# Altium project BackPlane.PrjPcb
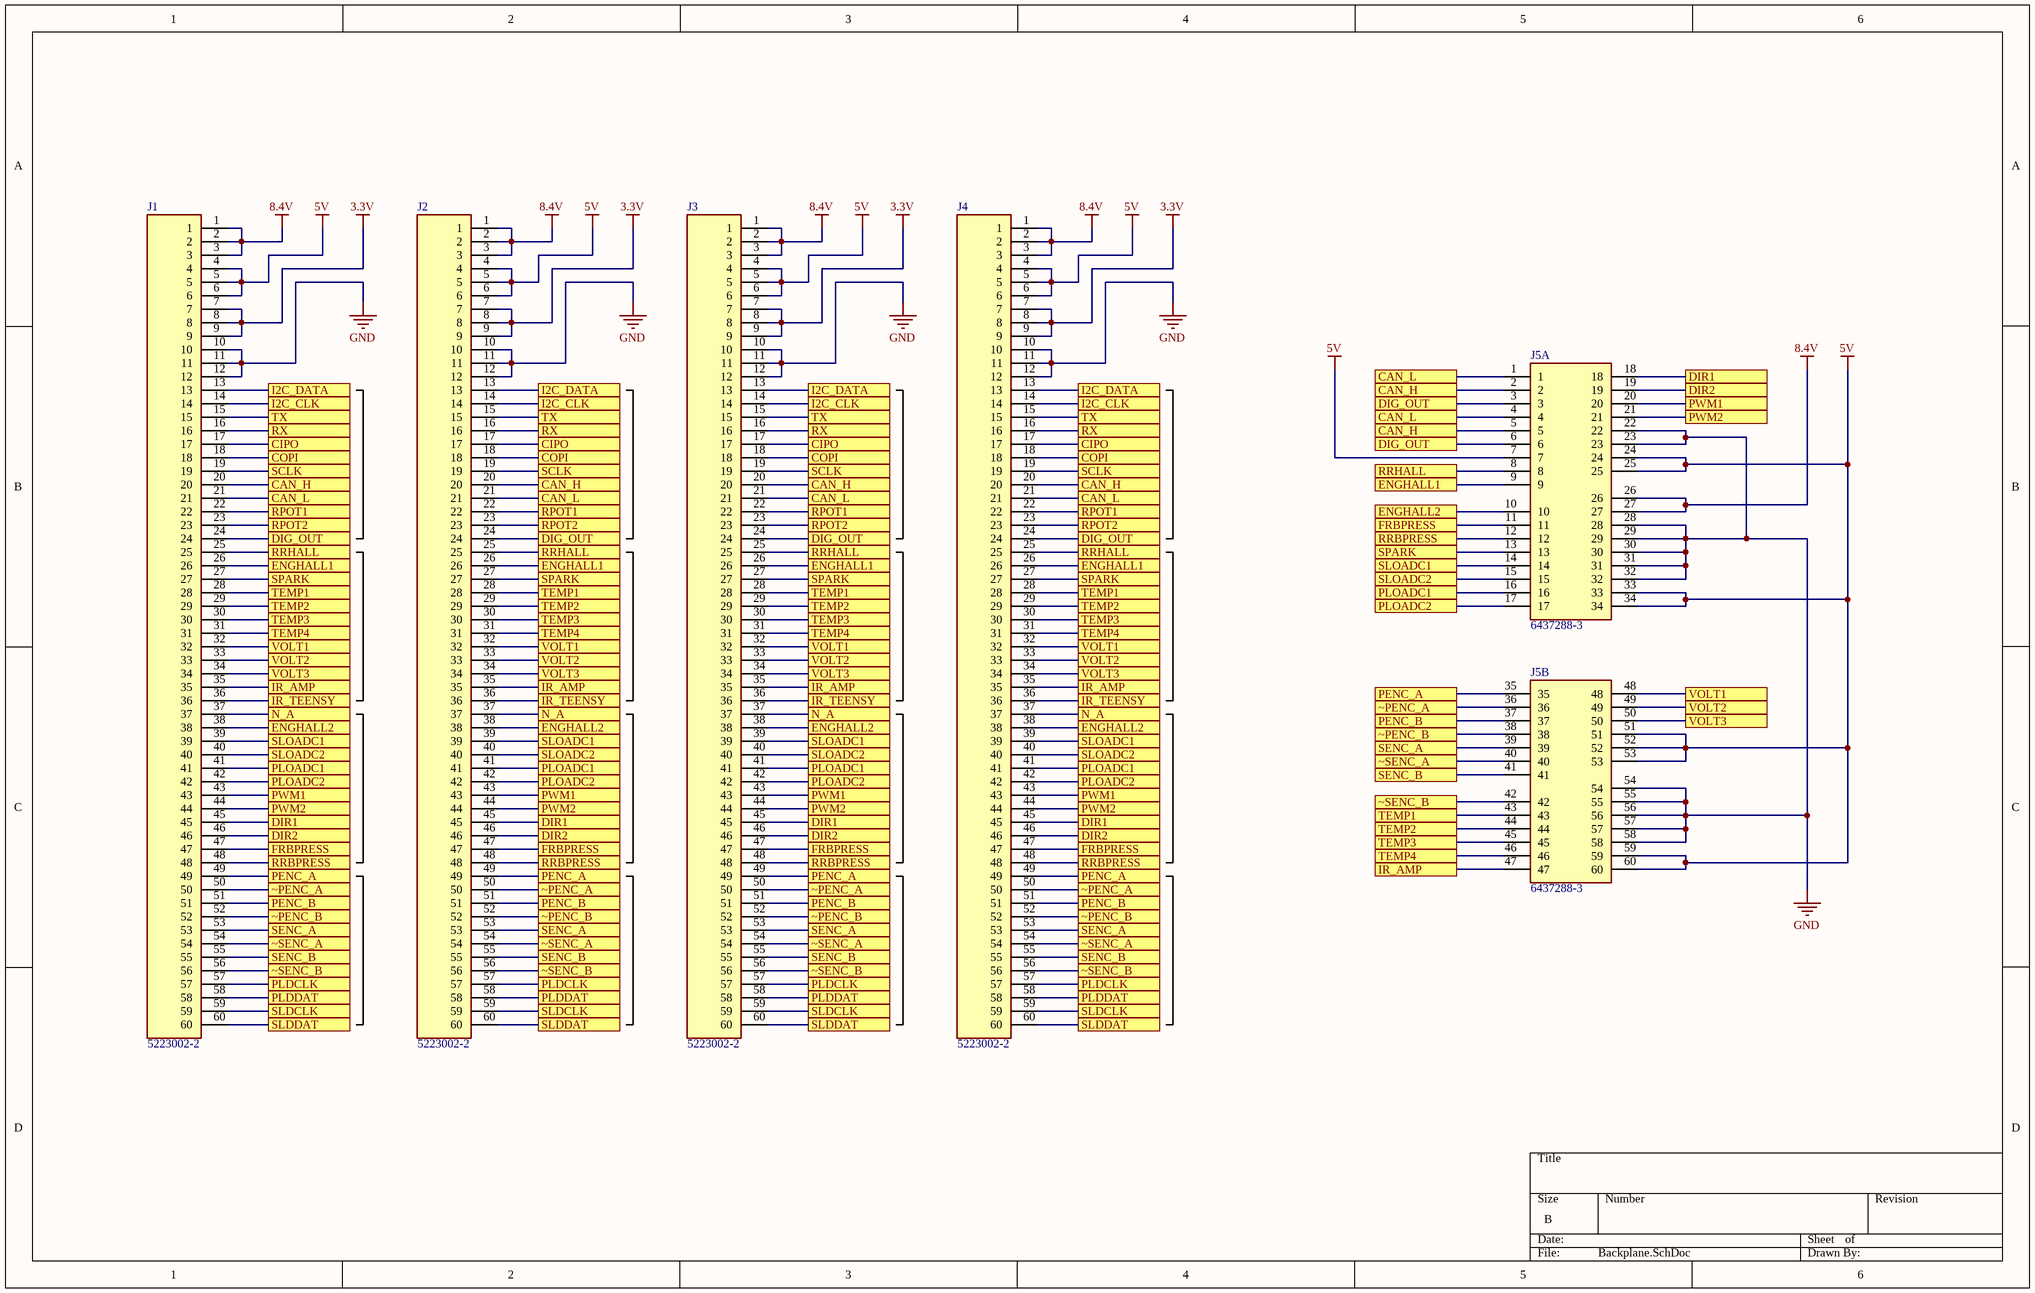
[diagram p0: Backplane.SchDoc]
1 sheet, 5 parts. Net scope: flat (ports and power ports of the same name join across sheets).
Board file: Backplane.PcbDoc

## Sheet Backplane.SchDoc
size B; SheetNumber: 1; SheetTotal: 1

### Parts
J1  5223002-2  [TE_5223002-2]
J2  5223002-2  [TE_5223002-2]
J3  5223002-2  [TE_5223002-2]
J4  5223002-2  [TE_5223002-2]
J5  6437288-3  [TE_6437288-3]  (parts A,B of 2)

### Ports
CAN_H (see Backplane[1B], Backplane[2B], Backplane[3B], Backplane[4B], Backplane[5B]), CAN_H (see Backplane[1B], Backplane[2B], Backplane[3B], Backplane[5B]), CAN_H (see Backplane[1B], Backplane[2B], Backplane[4B], Backplane[5B]), CAN_H (see Backplane[1B], Backplane[3B], Backplane[4B], Backplane[5B]), CAN_H (see Backplane[2B], Backplane[3B], Backplane[4B], Backplane[5B]), CAN_L (see Backplane[1B], Backplane[2B], Backplane[3B], Backplane[4B], Backplane[5B]), CAN_L (see Backplane[1B], Backplane[2B], Backplane[3B], Backplane[5B]), CAN_L (see Backplane[1B], Backplane[2B], Backplane[4B], Backplane[5B]), CAN_L (see Backplane[1B], Backplane[3B], Backplane[4B], Backplane[5B]), CAN_L (see Backplane[2B], Backplane[3B], Backplane[4B], Backplane[5B]), CIPO (see Backplane[1B], Backplane[2B], Backplane[3B]), CIPO (see Backplane[1B], Backplane[2B], Backplane[4B]), CIPO (see Backplane[1B], Backplane[3B], Backplane[4B]), CIPO (see Backplane[2B], Backplane[3B], Backplane[4B]), COPI (see Backplane[1B], Backplane[2B], Backplane[3B]), COPI (see Backplane[1B], Backplane[2B], Backplane[4B]), COPI (see Backplane[1B], Backplane[3B], Backplane[4B]), COPI (see Backplane[2B], Backplane[3B], Backplane[4B]), DIG_OUT (see Backplane[1B], Backplane[2B], Backplane[3B], Backplane[4B], Backplane[5B]), DIG_OUT (see Backplane[1B], Backplane[2B], Backplane[3B], Backplane[5B]), DIG_OUT (see Backplane[1B], Backplane[2B], Backplane[4B], Backplane[5B]), DIG_OUT (see Backplane[1B], Backplane[3B], Backplane[4B], Backplane[5B]), DIG_OUT (see Backplane[2B], Backplane[3B], Backplane[4B], Backplane[5B]), DIR1 (see Backplane[1C], Backplane[2C], Backplane[3C], Backplane[4C]), DIR1 (see Backplane[1C], Backplane[2C], Backplane[3C], Backplane[5B]), DIR1 (see Backplane[1C], Backplane[2C], Backplane[4C], Backplane[5B]), DIR1 (see Backplane[1C], Backplane[3C], Backplane[4C], Backplane[5B]), DIR1 (see Backplane[2C], Backplane[3C], Backplane[4C], Backplane[5B]), DIR2 (see Backplane[1C], Backplane[2C], Backplane[3C], Backplane[4C]), DIR2 (see Backplane[1C], Backplane[2C], Backplane[3C], Backplane[5B]), DIR2 (see Backplane[1C], Backplane[2C], Backplane[4C], Backplane[5B]), DIR2 (see Backplane[1C], Backplane[3C], Backplane[4C], Backplane[5B]), DIR2 (see Backplane[2C], Backplane[3C], Backplane[4C], Backplane[5B]), ENGHALL1 (see Backplane[1B], Backplane[2B], Backplane[3B], Backplane[4B]), ENGHALL1 (see Backplane[1B], Backplane[2B], Backplane[3B], Backplane[5B]), ENGHALL1 (see Backplane[1B], Backplane[2B], Backplane[4B], Backplane[5B]), ENGHALL1 (see Backplane[1B], Backplane[3B], Backplane[4B], Backplane[5B]), ENGHALL1 (see Backplane[2B], Backplane[3B], Backplane[4B], Backplane[5B]), ENGHALL2 (see Backplane[1C], Backplane[2C], Backplane[3C], Backplane[4C]), ENGHALL2 (see Backplane[1C], Backplane[2C], Backplane[3C], Backplane[5B]), ENGHALL2 (see Backplane[1C], Backplane[2C], Backplane[4C], Backplane[5B]), ENGHALL2 (see Backplane[1C], Backplane[3C], Backplane[4C], Backplane[5B]), ENGHALL2 (see Backplane[2C], Backplane[3C], Backplane[4C], Backplane[5B]), FRBPRESS (see Backplane[1C], Backplane[2C], Backplane[3C], Backplane[4C]), FRBPRESS (see Backplane[1C], Backplane[2C], Backplane[3C], Backplane[5B]), FRBPRESS (see Backplane[1C], Backplane[2C], Backplane[4C], Backplane[5B]), FRBPRESS (see Backplane[1C], Backplane[3C], Backplane[4C], Backplane[5B]), FRBPRESS (see Backplane[2C], Backplane[3C], Backplane[4C], Backplane[5B]), I2C_CLK (see Backplane[1B], Backplane[2B], Backplane[3B]), I2C_CLK (see Backplane[1B], Backplane[2B], Backplane[4B]), I2C_CLK (see Backplane[1B], Backplane[3B], Backplane[4B]), I2C_CLK (see Backplane[2B], Backplane[3B], Backplane[4B]), I2C_DATA (see Backplane[1B], Backplane[2B], Backplane[3B]), I2C_DATA (see Backplane[1B], Backplane[2B], Backplane[4B]), I2C_DATA (see Backplane[1B], Backplane[3B], Backplane[4B]), I2C_DATA (see Backplane[2B], Backplane[3B], Backplane[4B]), IR_AMP (see Backplane[1C], Backplane[2C], Backplane[3C], Backplane[4C]), IR_AMP (see Backplane[1C], Backplane[2C], Backplane[3C], Backplane[5C]), IR_AMP (see Backplane[1C], Backplane[2C], Backplane[4C], Backplane[5C]), IR_AMP (see Backplane[1C], Backplane[3C], Backplane[4C], Backplane[5C]), IR_AMP (see Backplane[2C], Backplane[3C], Backplane[4C], Backplane[5C]), IR_TEENSY (see Backplane[1C], Backplane[2C], Backplane[3C]), IR_TEENSY (see Backplane[1C], Backplane[2C], Backplane[4C]), IR_TEENSY (see Backplane[1C], Backplane[3C], Backplane[4C]), IR_TEENSY (see Backplane[2C], Backplane[3C], Backplane[4C]), N_A (see Backplane[1C], Backplane[2C], Backplane[3C]), N_A (see Backplane[1C], Backplane[2C], Backplane[4C]), N_A (see Backplane[1C], Backplane[3C], Backplane[4C]), N_A (see Backplane[2C], Backplane[3C], Backplane[4C]), PENC_A (see Backplane[1C], Backplane[2C], Backplane[3C], Backplane[4C]), PENC_A (see Backplane[1C], Backplane[2C], Backplane[3C], Backplane[5C]), PENC_A (see Backplane[1C], Backplane[2C], Backplane[4C], Backplane[5C]), PENC_A (see Backplane[1C], Backplane[3C], Backplane[4C], Backplane[5C]), PENC_A (see Backplane[2C], Backplane[3C], Backplane[4C], Backplane[5C]), PENC_B (see Backplane[1C], Backplane[2C], Backplane[3C], Backplane[4C]), PENC_B (see Backplane[1C], Backplane[2C], Backplane[3C], Backplane[5C]), PENC_B (see Backplane[1C], Backplane[2C], Backplane[4C], Backplane[5C]), PENC_B (see Backplane[1C], Backplane[3C], Backplane[4C], Backplane[5C]), PENC_B (see Backplane[2C], Backplane[3C], Backplane[4C], Backplane[5C]), PLDCLK (see Backplane[1D], Backplane[2D], Backplane[3D]), PLDCLK (see Backplane[1D], Backplane[2D], Backplane[4D]), PLDCLK (see Backplane[1D], Backplane[3D], Backplane[4D]), PLDCLK (see Backplane[2D], Backplane[3D], Backplane[4D]), PLDDAT (see Backplane[1D], Backplane[2D], Backplane[3D]), PLDDAT (see Backplane[1D], Backplane[2D], Backplane[4D]), PLDDAT (see Backplane[1D], Backplane[3D], Backplane[4D]), PLDDAT (see Backplane[2D], Backplane[3D], Backplane[4D]), PLOADC1 (see Backplane[1C], Backplane[2C], Backplane[3C], Backplane[4C]), PLOADC1 (see Backplane[1C], Backplane[2C], Backplane[3C], Backplane[5B]), PLOADC1 (see Backplane[1C], Backplane[2C], Backplane[4C], Backplane[5B]), PLOADC1 (see Backplane[1C], Backplane[3C], Backplane[4C], Backplane[5B]), PLOADC1 (see Backplane[2C], Backplane[3C], Backplane[4C], Backplane[5B]), PLOADC2 (see Backplane[1C], Backplane[2C], Backplane[3C], Backplane[4C]), PLOADC2 (see Backplane[1C], Backplane[2C], Backplane[3C], Backplane[5B]), PLOADC2 (see Backplane[1C], Backplane[2C], Backplane[4C], Backplane[5B]), PLOADC2 (see Backplane[1C], Backplane[3C], Backplane[4C], Backplane[5B]), PLOADC2 (see Backplane[2C], Backplane[3C], Backplane[4C], Backplane[5B]), PWM1 (see Backplane[1C], Backplane[2C], Backplane[3C], Backplane[4C]), PWM1 (see Backplane[1C], Backplane[2C], Backplane[3C], Backplane[5B]), PWM1 (see Backplane[1C], Backplane[2C], Backplane[4C], Backplane[5B]), PWM1 (see Backplane[1C], Backplane[3C], Backplane[4C], Backplane[5B]), PWM1 (see Backplane[2C], Backplane[3C], Backplane[4C], Backplane[5B]), PWM2 (see Backplane[1C], Backplane[2C], Backplane[3C], Backplane[4C]), PWM2 (see Backplane[1C], Backplane[2C], Backplane[3C], Backplane[5B]), PWM2 (see Backplane[1C], Backplane[2C], Backplane[4C], Backplane[5B]), PWM2 (see Backplane[1C], Backplane[3C], Backplane[4C], Backplane[5B]), PWM2 (see Backplane[2C], Backplane[3C], Backplane[4C], Backplane[5B]), RPOT1 (see Backplane[1B], Backplane[2B], Backplane[3B]), RPOT1 (see Backplane[1B], Backplane[2B], Backplane[4B]), RPOT1 (see Backplane[1B], Backplane[3B], Backplane[4B]), RPOT1 (see Backplane[2B], Backplane[3B], Backplane[4B]), RPOT2 (see Backplane[1B], Backplane[2B], Backplane[3B]), RPOT2 (see Backplane[1B], Backplane[2B], Backplane[4B]), RPOT2 (see Backplane[1B], Backplane[3B], Backplane[4B]), RPOT2 (see Backplane[2B], Backplane[3B], Backplane[4B]), RRBPRESS (see Backplane[1C], Backplane[2C], Backplane[3C], Backplane[4C]), RRBPRESS (see Backplane[1C], Backplane[2C], Backplane[3C], Backplane[5B]), RRBPRESS (see Backplane[1C], Backplane[2C], Backplane[4C], Backplane[5B]), RRBPRESS (see Backplane[1C], Backplane[3C], Backplane[4C], Backplane[5B]), RRBPRESS (see Backplane[2C], Backplane[3C], Backplane[4C], Backplane[5B]), RRHALL (see Backplane[1B], Backplane[2B], Backplane[3B], Backplane[4B]), RRHALL (see Backplane[1B], Backplane[2B], Backplane[3B], Backplane[5B]), RRHALL (see Backplane[1B], Backplane[2B], Backplane[4B], Backplane[5B]), RRHALL (see Backplane[1B], Backplane[3B], Backplane[4B], Backplane[5B]), RRHALL (see Backplane[2B], Backplane[3B], Backplane[4B], Backplane[5B]), RX (see Backplane[1B], Backplane[2B], Backplane[3B]), RX (see Backplane[1B], Backplane[2B], Backplane[4B]), RX (see Backplane[1B], Backplane[3B], Backplane[4B]), RX (see Backplane[2B], Backplane[3B], Backplane[4B]), SCLK (see Backplane[1B], Backplane[2B], Backplane[3B]), SCLK (see Backplane[1B], Backplane[2B], Backplane[4B]), SCLK (see Backplane[1B], Backplane[3B], Backplane[4B]), SCLK (see Backplane[2B], Backplane[3B], Backplane[4B]), SENC_A (see Backplane[1C], Backplane[2C], Backplane[3C], Backplane[4C]), SENC_A (see Backplane[1C], Backplane[2C], Backplane[3C], Backplane[5C]), SENC_A (see Backplane[1C], Backplane[2C], Backplane[4C], Backplane[5C]), SENC_A (see Backplane[1C], Backplane[3C], Backplane[4C], Backplane[5C]), SENC_A (see Backplane[2C], Backplane[3C], Backplane[4C], Backplane[5C]), SENC_B (see Backplane[1C], Backplane[2C], Backplane[3C], Backplane[4C]), SENC_B (see Backplane[1C], Backplane[2C], Backplane[3C], Backplane[5C]), SENC_B (see Backplane[1C], Backplane[2C], Backplane[4C], Backplane[5C]), SENC_B (see Backplane[1C], Backplane[3C], Backplane[4C], Backplane[5C]), SENC_B (see Backplane[2C], Backplane[3C], Backplane[4C], Backplane[5C]), SLDCLK (see Backplane[1D], Backplane[2D], Backplane[3D]), SLDCLK (see Backplane[1D], Backplane[2D], Backplane[4D]), SLDCLK (see Backplane[1D], Backplane[3D], Backplane[4D]), SLDCLK (see Backplane[2D], Backplane[3D], Backplane[4D]), SLDDAT (see Backplane[1D], Backplane[2D], Backplane[3D]), SLDDAT (see Backplane[1D], Backplane[2D], Backplane[4D]), SLDDAT (see Backplane[1D], Backplane[3D], Backplane[4D]), SLDDAT (see Backplane[2D], Backplane[3D], Backplane[4D]), SLOADC1 (see Backplane[1C], Backplane[2C], Backplane[3C], Backplane[4C]), SLOADC1 (see Backplane[1C], Backplane[2C], Backplane[3C], Backplane[5B]), SLOADC1 (see Backplane[1C], Backplane[2C], Backplane[4C], Backplane[5B]), SLOADC1 (see Backplane[1C], Backplane[3C], Backplane[4C], Backplane[5B]), SLOADC1 (see Backplane[2C], Backplane[3C], Backplane[4C], Backplane[5B]), SLOADC2 (see Backplane[1C], Backplane[2C], Backplane[3C], Backplane[4C]), SLOADC2 (see Backplane[1C], Backplane[2C], Backplane[3C], Backplane[5B]), SLOADC2 (see Backplane[1C], Backplane[2C], Backplane[4C], Backplane[5B]), SLOADC2 (see Backplane[1C], Backplane[3C], Backplane[4C], Backplane[5B]), SLOADC2 (see Backplane[2C], Backplane[3C], Backplane[4C], Backplane[5B]), SPARK (see Backplane[1B], Backplane[2B], Backplane[3B], Backplane[4B]), SPARK (see Backplane[1B], Backplane[2B], Backplane[3B], Backplane[5B]), SPARK (see Backplane[1B], Backplane[2B], Backplane[4B], Backplane[5B]), SPARK (see Backplane[1B], Backplane[3B], Backplane[4B], Backplane[5B]), SPARK (see Backplane[2B], Backplane[3B], Backplane[4B], Backplane[5B]), TEMP1 (see Backplane[1B], Backplane[2B], Backplane[3B], Backplane[4B]), TEMP1 (see Backplane[1B], Backplane[2B], Backplane[3B], Backplane[5C]), TEMP1 (see Backplane[1B], Backplane[2B], Backplane[4B], Backplane[5C]), TEMP1 (see Backplane[1B], Backplane[3B], Backplane[4B], Backplane[5C]), TEMP1 (see Backplane[2B], Backplane[3B], Backplane[4B], Backplane[5C]), TEMP2 (see Backplane[1B], Backplane[2B], Backplane[3B], Backplane[4B]), TEMP2 (see Backplane[1B], Backplane[2B], Backplane[3B], Backplane[5C]), TEMP2 (see Backplane[1B], Backplane[2B], Backplane[4B], Backplane[5C]), TEMP2 (see Backplane[1B], Backplane[3B], Backplane[4B], Backplane[5C]), TEMP2 (see Backplane[2B], Backplane[3B], Backplane[4B], Backplane[5C]), TEMP3 (see Backplane[1B], Backplane[2B], Backplane[3B], Backplane[4B]), TEMP3 (see Backplane[1B], Backplane[2B], Backplane[3B], Backplane[5C]), TEMP3 (see Backplane[1B], Backplane[2B], Backplane[4B], Backplane[5C]), TEMP3 (see Backplane[1B], Backplane[3B], Backplane[4B], Backplane[5C]), TEMP3 (see Backplane[2B], Backplane[3B], Backplane[4B], Backplane[5C]), TEMP4 (see Backplane[1B], Backplane[2B], Backplane[3B], Backplane[4B]), TEMP4 (see Backplane[1B], Backplane[2B], Backplane[3B], Backplane[5C]), TEMP4 (see Backplane[1B], Backplane[2B], Backplane[4B], Backplane[5C]), TEMP4 (see Backplane[1B], Backplane[3B], Backplane[4B], Backplane[5C]), TEMP4 (see Backplane[2B], Backplane[3B], Backplane[4B], Backplane[5C]), TX (see Backplane[1B], Backplane[2B], Backplane[3B]), TX (see Backplane[1B], Backplane[2B], Backplane[4B]), TX (see Backplane[1B], Backplane[3B], Backplane[4B]), TX (see Backplane[2B], Backplane[3B], Backplane[4B]), VOLT1 (see Backplane[1C], Backplane[2C], Backplane[3C], Backplane[4C]), VOLT1 (see Backplane[1C], Backplane[2C], Backplane[3C], Backplane[5C]), VOLT1 (see Backplane[1C], Backplane[2C], Backplane[4C], Backplane[5C]), VOLT1 (see Backplane[1C], Backplane[3C], Backplane[4C], Backplane[5C]), VOLT1 (see Backplane[2C], Backplane[3C], Backplane[4C], Backplane[5C]), VOLT2 (see Backplane[1C], Backplane[2C], Backplane[3C], Backplane[4C]), VOLT2 (see Backplane[1C], Backplane[2C], Backplane[3C], Backplane[5C]), VOLT2 (see Backplane[1C], Backplane[2C], Backplane[4C], Backplane[5C]), VOLT2 (see Backplane[1C], Backplane[3C], Backplane[4C], Backplane[5C]), VOLT2 (see Backplane[2C], Backplane[3C], Backplane[4C], Backplane[5C]), VOLT3 (see Backplane[1C], Backplane[2C], Backplane[3C], Backplane[4C]), VOLT3 (see Backplane[1C], Backplane[2C], Backplane[3C], Backplane[5C]), VOLT3 (see Backplane[1C], Backplane[2C], Backplane[4C], Backplane[5C]), VOLT3 (see Backplane[1C], Backplane[3C], Backplane[4C], Backplane[5C]), VOLT3 (see Backplane[2C], Backplane[3C], Backplane[4C], Backplane[5C]), ~PENC_A (see Backplane[1C], Backplane[2C], Backplane[3C], Backplane[4C]), ~PENC_A (see Backplane[1C], Backplane[2C], Backplane[3C], Backplane[5C]), ~PENC_A (see Backplane[1C], Backplane[2C], Backplane[4C], Backplane[5C]), ~PENC_A (see Backplane[1C], Backplane[3C], Backplane[4C], Backplane[5C]), ~PENC_A (see Backplane[2C], Backplane[3C], Backplane[4C], Backplane[5C]), ~PENC_B (see Backplane[1C], Backplane[2C], Backplane[3C], Backplane[4C]), ~PENC_B (see Backplane[1C], Backplane[2C], Backplane[3C], Backplane[5C]), ~PENC_B (see Backplane[1C], Backplane[2C], Backplane[4C], Backplane[5C]), ~PENC_B (see Backplane[1C], Backplane[3C], Backplane[4C], Backplane[5C]), ~PENC_B (see Backplane[2C], Backplane[3C], Backplane[4C], Backplane[5C]), ~SENC_A (see Backplane[1C], Backplane[2C], Backplane[3C], Backplane[4C]), ~SENC_A (see Backplane[1C], Backplane[2C], Backplane[3C], Backplane[5C]), ~SENC_A (see Backplane[1C], Backplane[2C], Backplane[4C], Backplane[5C]), ~SENC_A (see Backplane[1C], Backplane[3C], Backplane[4C], Backplane[5C]), ~SENC_A (see Backplane[2C], Backplane[3C], Backplane[4C], Backplane[5C]), ~SENC_B (see Backplane[1D], Backplane[2D], Backplane[3D], Backplane[4D]), ~SENC_B (see Backplane[1D], Backplane[2D], Backplane[3D], Backplane[5C]), ~SENC_B (see Backplane[1D], Backplane[2D], Backplane[4D], Backplane[5C]), ~SENC_B (see Backplane[1D], Backplane[3D], Backplane[4D], Backplane[5C]), ~SENC_B (see Backplane[2D], Backplane[3D], Backplane[4D], Backplane[5C])

### Nets
3.3V: J1.7 J1.8 J1.9 J2.7 J2.8 J2.9 J3.7 J3.8 J3.9 J4.7 J4.8 J4.9
5V: J1.4 J1.5 J1.6 J2.4 J2.5 J2.6 J3.4 J3.5 J3.6 J4.4 J4.5 J4.6 J5.7 J5.24 J5.25 J5.33 J5.34 J5.51 J5.52 J5.53 J5.59 J5.60
8.4V: J1.1 J1.2 J1.3 J2.1 J2.2 J2.3 J3.1 J3.2 J3.3 J4.1 J4.2 J4.3 J5.26 J5.27
GND: J1.10 J1.11 J1.12 J2.10 J2.11 J2.12 J3.10 J3.11 J3.12 J4.10 J4.11 J4.12 J5.22 J5.23 J5.28 J5.29 J5.30 J5.31 J5.32 J5.54 J5.55 J5.56 J5.57 J5.58
NetJ1_13: J1.13 J2.13 J3.13 J4.13 ; port I2C_DATA
NetJ1_14: J1.14 J2.14 J3.14 J4.14 ; port I2C_CLK
NetJ1_15: J1.15 J2.15 J3.15 J4.15 ; port TX
NetJ1_16: J1.16 J2.16 J3.16 J4.16 ; port RX
NetJ1_17: J1.17 J2.17 J3.17 J4.17 ; port CIPO
NetJ1_18: J1.18 J2.18 J3.18 J4.18 ; port COPI
NetJ1_19: J1.19 J2.19 J3.19 J4.19 ; port SCLK
NetJ1_20: J1.20 J2.20 J3.20 J4.20 J5.2 J5.5 ; port CAN_H
NetJ1_21: J1.21 J2.21 J3.21 J4.21 J5.1 J5.4 ; port CAN_L
NetJ1_22: J1.22 J2.22 J3.22 J4.22 ; port RPOT1
NetJ1_23: J1.23 J2.23 J3.23 J4.23 ; port RPOT2
NetJ1_24: J1.24 J2.24 J3.24 J4.24 J5.3 J5.6 ; port DIG_OUT
NetJ1_25: J1.25 J2.25 J3.25 J4.25 J5.8 ; port RRHALL
NetJ1_26: J1.26 J2.26 J3.26 J4.26 J5.9 ; port ENGHALL1
NetJ1_27: J1.27 J2.27 J3.27 J4.27 J5.13 ; port SPARK
NetJ1_28: J1.28 J2.28 J3.28 J4.28 J5.43 ; port TEMP1
NetJ1_29: J1.29 J2.29 J3.29 J4.29 J5.44 ; port TEMP2
NetJ1_30: J1.30 J2.30 J3.30 J4.30 J5.45 ; port TEMP3
NetJ1_31: J1.31 J2.31 J3.31 J4.31 J5.46 ; port TEMP4
NetJ1_32: J1.32 J2.32 J3.32 J4.32 J5.48 ; port VOLT1
NetJ1_33: J1.33 J2.33 J3.33 J4.33 J5.49 ; port VOLT2
NetJ1_34: J1.34 J2.34 J3.34 J4.34 J5.50 ; port VOLT3
NetJ1_35: J1.35 J2.35 J3.35 J4.35 J5.47 ; port IR_AMP
NetJ1_36: J1.36 J2.36 J3.36 J4.36 ; port IR_TEENSY
NetJ1_37: J1.37 J2.37 J3.37 J4.37 ; port N_A
NetJ1_38: J1.38 J2.38 J3.38 J4.38 J5.10 ; port ENGHALL2
NetJ1_39: J1.39 J2.39 J3.39 J4.39 J5.14 ; port SLOADC1
NetJ1_40: J1.40 J2.40 J3.40 J4.40 J5.15 ; port SLOADC2
NetJ1_41: J1.41 J2.41 J3.41 J4.41 J5.16 ; port PLOADC1
NetJ1_42: J1.42 J2.42 J3.42 J4.42 J5.17 ; port PLOADC2
NetJ1_43: J1.43 J2.43 J3.43 J4.43 J5.20 ; port PWM1
NetJ1_44: J1.44 J2.44 J3.44 J4.44 J5.21 ; port PWM2
NetJ1_45: J1.45 J2.45 J3.45 J4.45 J5.18 ; port DIR1
NetJ1_46: J1.46 J2.46 J3.46 J4.46 J5.19 ; port DIR2
NetJ1_47: J1.47 J2.47 J3.47 J4.47 J5.11 ; port FRBPRESS
NetJ1_48: J1.48 J2.48 J3.48 J4.48 J5.12 ; port RRBPRESS
NetJ1_49: J1.49 J2.49 J3.49 J4.49 J5.35 ; port PENC_A
NetJ1_50: J1.50 J2.50 J3.50 J4.50 J5.36 ; port ~PENC_A
NetJ1_51: J1.51 J2.51 J3.51 J4.51 J5.37 ; port PENC_B
NetJ1_52: J1.52 J2.52 J3.52 J4.52 J5.38 ; port ~PENC_B
NetJ1_53: J1.53 J2.53 J3.53 J4.53 J5.39 ; port SENC_A
NetJ1_54: J1.54 J2.54 J3.54 J4.54 J5.40 ; port ~SENC_A
NetJ1_55: J1.55 J2.55 J3.55 J4.55 J5.41 ; port SENC_B
NetJ1_56: J1.56 J2.56 J3.56 J4.56 J5.42 ; port ~SENC_B
NetJ1_57: J1.57 J2.57 J3.57 J4.57 ; port PLDCLK
NetJ1_58: J1.58 J2.58 J3.58 J4.58 ; port PLDDAT
NetJ1_59: J1.59 J2.59 J3.59 J4.59 ; port SLDCLK
NetJ1_60: J1.60 J2.60 J3.60 J4.60 ; port SLDDAT

### Library data of the parts
J5 = 6437288-3: Rectangular Power Connector, Super Seal Series, Through Hole, Receptacle, 60, 1.5 mm, Pin; MF: TE Connectivity; Package: None; TE_purchase_URL: https://www.te.com/usa-en/product-6437288-3.html?te_bu=Cor&te_type=disp&te_campaign=seda_glo_cor-seda-global-disp-prtnr-fy19-seda-model-bom-cta_sma-317_1&elqCampaignId=32493; Value: *; MP: 6437288-3; EU_RoHS_Compliance: Compliant; SnapEDA_Link: https://www.snapeda.com/parts/6437288-3/TE%20Connectivity%20AMP%20Connectors/view-part/401864/?ref=snap
J1-J4 = 5223002-2: Package: None; Price: None; Value: *; MP: 5223002-2; Availability: Unavailable